# EAGLE design VolumeKnob (EAGLE 7.3.0)
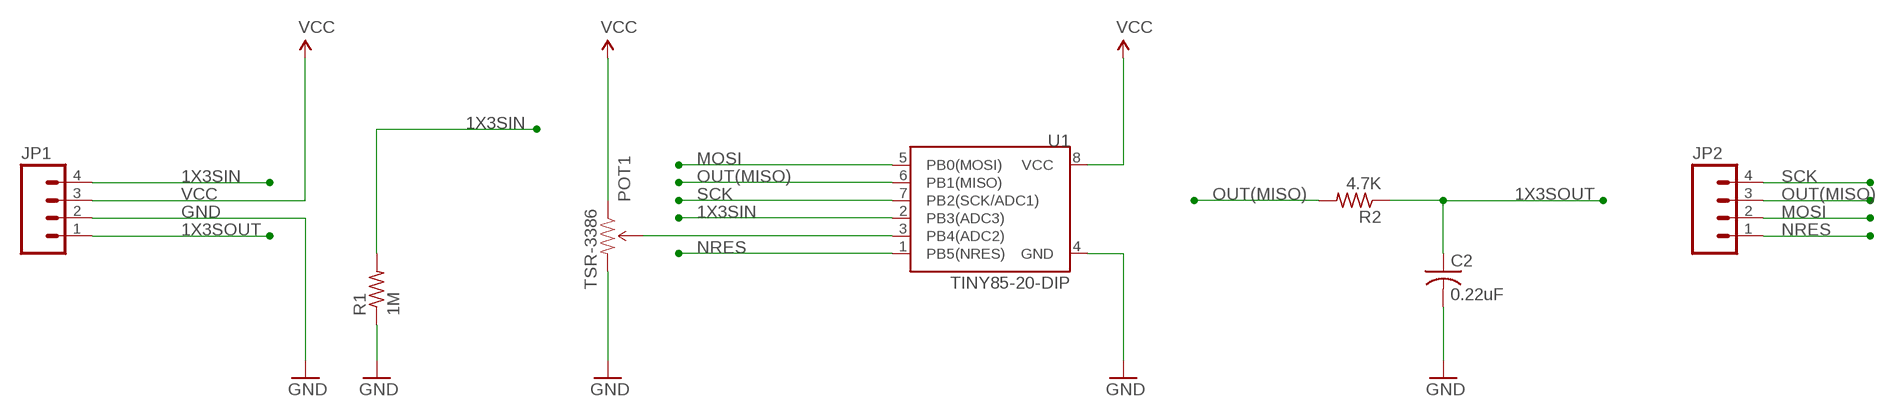
[diagram p0: schematic, sheet 1]

## Parts
C2  0.22uF  C-USC0603  [C0603]
JP1  M04PTH  [1X04]
JP2  M04PTH  [1X04]
POT1  TSR-3386  TRIMPOT-PTH-KNOB  [3386U]
R1  1M  R-US_R0603  [R0603]
R2  4.7K  R-US_R0603  [R0603]
U1  TINY85-20-DIP  ATTINY45TINY85-20-DIP  [DIP08]

## Nets
1X3SIN: JP1.4 R1.2 U1.2(PB3(ADC3))
1X3SOUT: C2.1 JP1.1 R2.1
GND: C2.2 JP1.2 POT1.3(CW) R1.1 U1.4(GND)
MOSI: JP2.2 U1.5(PB0(MOSI))
N$1: POT1.2(WIPER) U1.3(PB4(ADC2))
NRES: JP2.1 U1.1(PB5(NRES))
OUT(MISO): JP2.3 R2.2 U1.6(PB1(MISO))
SCK: JP2.4 U1.7(PB2(SCK/ADC1))
VCC: JP1.3 POT1.1(CCW) U1.8(VCC)

## Library data of the parts
C2 = adafruit:C-US: CAPACITOR, American symbol
JP1 JP2 = SparkFun-Connectors:M04: Header 4 Standard 4-pin 0.1" header. Use with straight break away headers (SKU : PRT-00116), right angle break away headers (PRT-00553), swiss pins (PRT-00743), machine pins (PRT-00117), and female headers (PRT-00115). Molex polarized connector foot print use with SKU : PRT-08231 with associated crimp pins and housings. 1MM SMD Version SKU: PRT-10208
POT1 = SparkFun-Electromechanical:TRIMPOT: Various small potentiometers for "set-and-forget" applications; PROD_ID: RES-09730
R1 R2 = adafruit:R-US_: RESISTOR, American symbol
U1 = SparkFun-DigitalIC:ATTINY45: Atmel 8-pin 2/4/8kB flash uC; PROD_ID: IC-09445

## Board
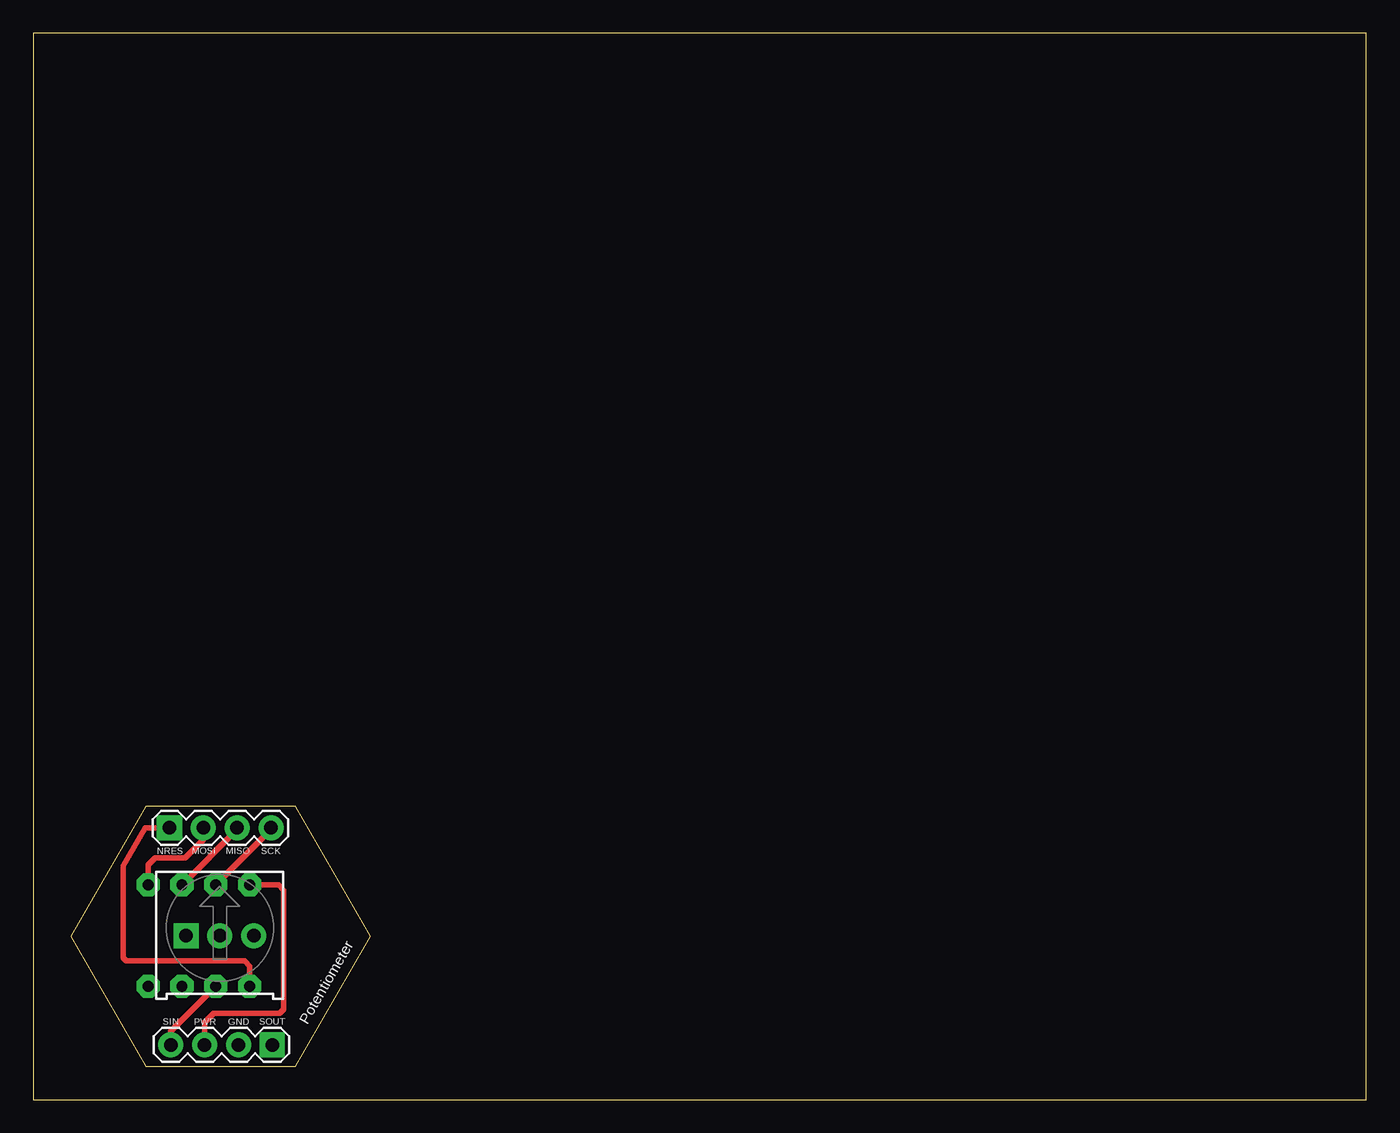
[diagram p1: board, top side]
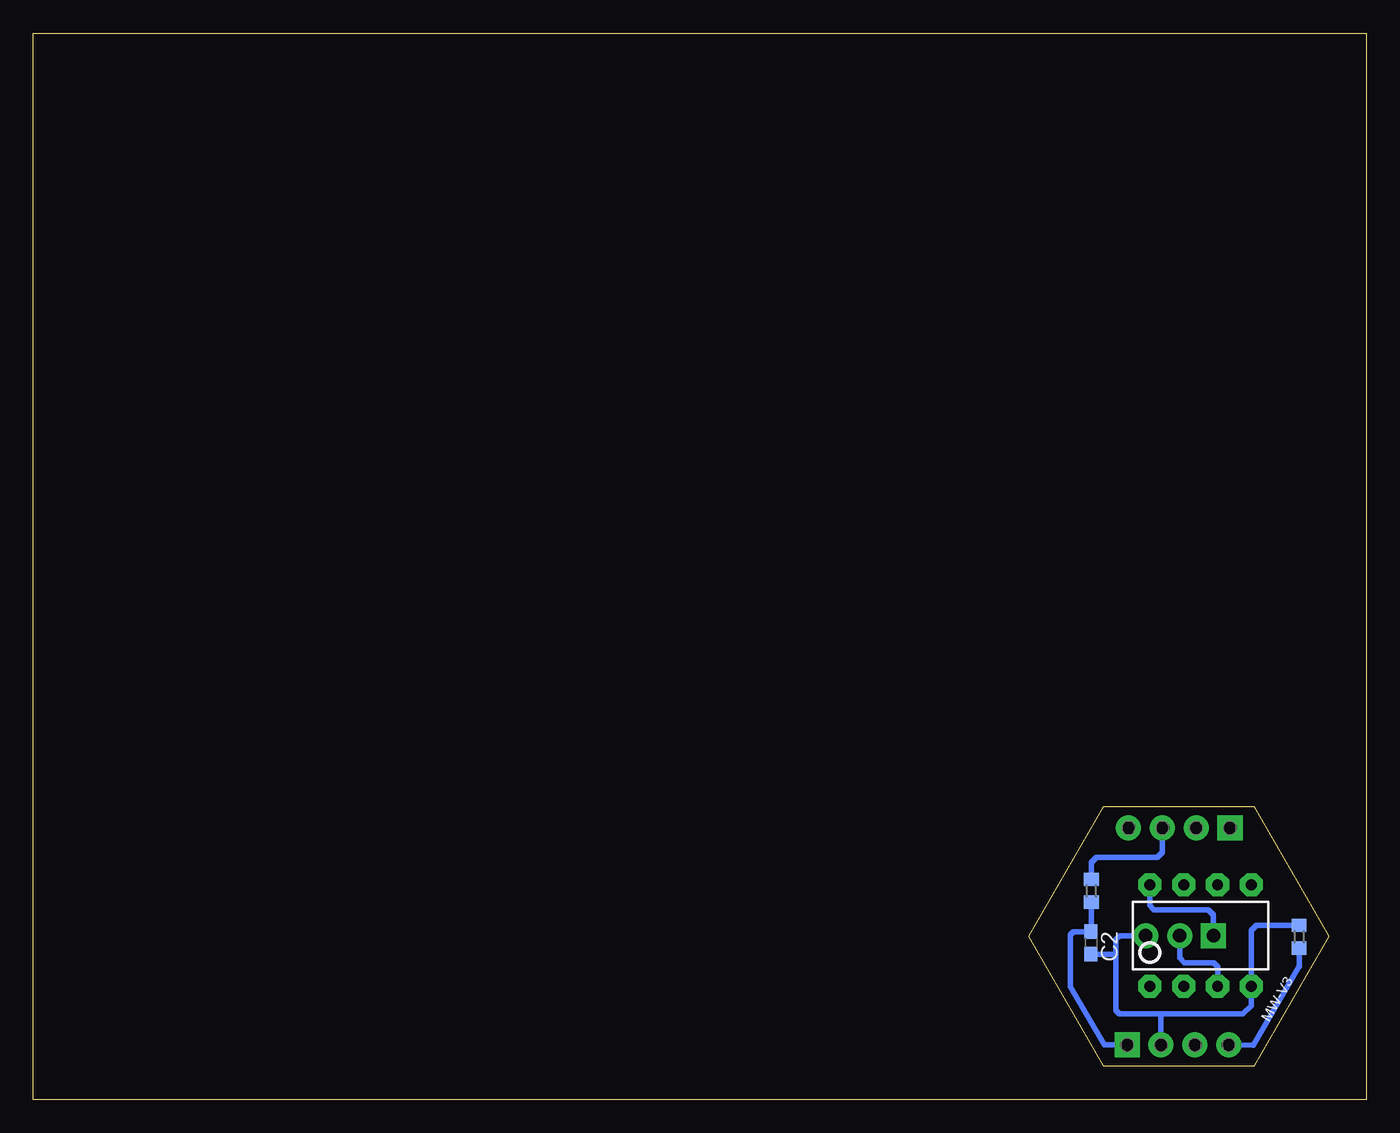
[diagram p2: board, bottom side, seen from below]

Size 100 x 80 mm. Coordinates in mm from the lower left corner, seen from the top.
Outline: 0,0 100,0 100,80 0,80 0,0
Outline: 8.45,2.5 19.7,2.5 25.32,12.24 19.7,21.98 8.45,21.98 2.82,12.24 8.45,2.5
Copper layers (1*16): Top 0.035mm / dielectric 1.5mm / Bottom 0.035mm
Design rules "default *": minimum track width 10mil, minimum drill 24mil, track to track 8mil, track to pad 8mil, pad to pad 8mil, via to via 8mil, smd to smd 8mil, copper to edge 0mil, drill to drill 8mil, minimum pad ring 10mil, minimum via ring 8mil, stop-mask expansion 4mil, vias tented up to drill 0mil, thermal gap 10mil

### Footprints (pad centres in the part's own frame; a part is rotated, then mirrored left to right if it is on the bottom)
C0603 = smd 1.1 x 1: 1 -0.85,0; 2 0.85,0
1X04 = drill 1.016 pad 1.88 square: 1 0,0 | drill 1.016 pad 1.88: 2 2.54,0; 3 5.08,0; 4 7.62,0
3386U = drill 1.016 pad 1.88 square: 1 -2.54,-0.015 | drill 1.016 pad 1.88: 2 0,-0.015; 3 2.54,-0.015
R0603 = smd 1 x 1.1: 1 -0.85,0; 2 0.85,0
DIP08 = drill 0.813 pad 1.727 octagon: 1 -3.81,-3.81; 2 -1.27,-3.81; 3 1.27,-3.81; 4 3.81,-3.81; 5 3.81,3.81; 6 1.27,3.81; 7 -1.27,3.81; 8 -3.81,3.81

### Placement (x,y rotation side)
C2  20.65,11.76 270 bottom
JP1  17.93,4.1 180 top
JP2  10.21,20.38 0 top
POT1  14,12.31 0 top
R1  5.03,12.22 270 bottom
R2  20.62,15.67 90 bottom
U1  12.42,12.31 0 bottom

### Tracks (layer width: path | path; a pad name or v marks a point on that pad's centre or on a via)
1X3SIN
  Top 0.4: JP1.4 10.31,5.12 U1.2
  Bottom 0.4: R1.2 5.03,9.97 5.04,9.96 8.47,4.08 JP1.4
1X3SOUT
  Bottom 0.4: 21.98,12.59 22.21,12.36 22.21,8.46 22.2,8.45 19.65,4.09 JP1.1
  Bottom 0.406: 21.98,12.59 20.65,12.59 C2.1 20.62,12.61 R2.1
GND
  Bottom 0.4: POT1.3 18.49,12.29 | 18.77,10.87 18.77,6.68 18.52,6.43 15.28,6.43 | 15.28,6.43 9.25,6.43 8.64,7.04 8.64,8.47 U1.4 8.64,8.52 8.64,12.69 8.26,13.07 R1.1 | JP1.2 15.39,6.31 15.28,6.43
  Bottom 0.406: 18.77,10.87 18.77,11 | 18.77,11 18.77,12.01 18.49,12.29 | C2.2 18.86,10.91 18.77,11
MOSI
  Top 0.4: JP2.2 12.75,19.48 11.4,18.14 9.13,18.14 8.61,17.61 U1.5
N$1
  Bottom 0.4: POT1.2 13.99,10.62 13.65,10.27 11.44,10.27 11.12,9.96 11.12,8.52 U1.3
NRES
  Top 0.4: U1.1 16.23,10.01 15.85,10.39 6.99,10.39 6.73,10.64 6.73,17.51 6.76,17.54 8.41,20.37 JP2.1
OUT(MISO)
  Top 0.4: JP2.3 15.29,20.26 U1.6
  Bottom 0.4: JP2.3 15.29,18.55 15.67,18.17 20.26,18.17 20.64,17.79 20.64,16.54 R2.2
SCK
  Top 0.4: JP2.4 17.83,20.26 U1.7
VCC
  Top 0.4: JP1.3 12.85,5.78 13.54,6.46 18.49,6.46 18.78,6.76 18.78,15.71 18.39,16.1 16.24,16.1 U1.8
  Bottom 0.4: POT1.1 11.46,13.84 11.85,14.24 15.93,14.24 16.24,14.55 16.24,16.1 U1.8

### Text on the board
tPlace: NRES | MOSI | MISO | SCK | SIN | PWR | GND | SOUT | Potentiometer
bPlace: MW-V3